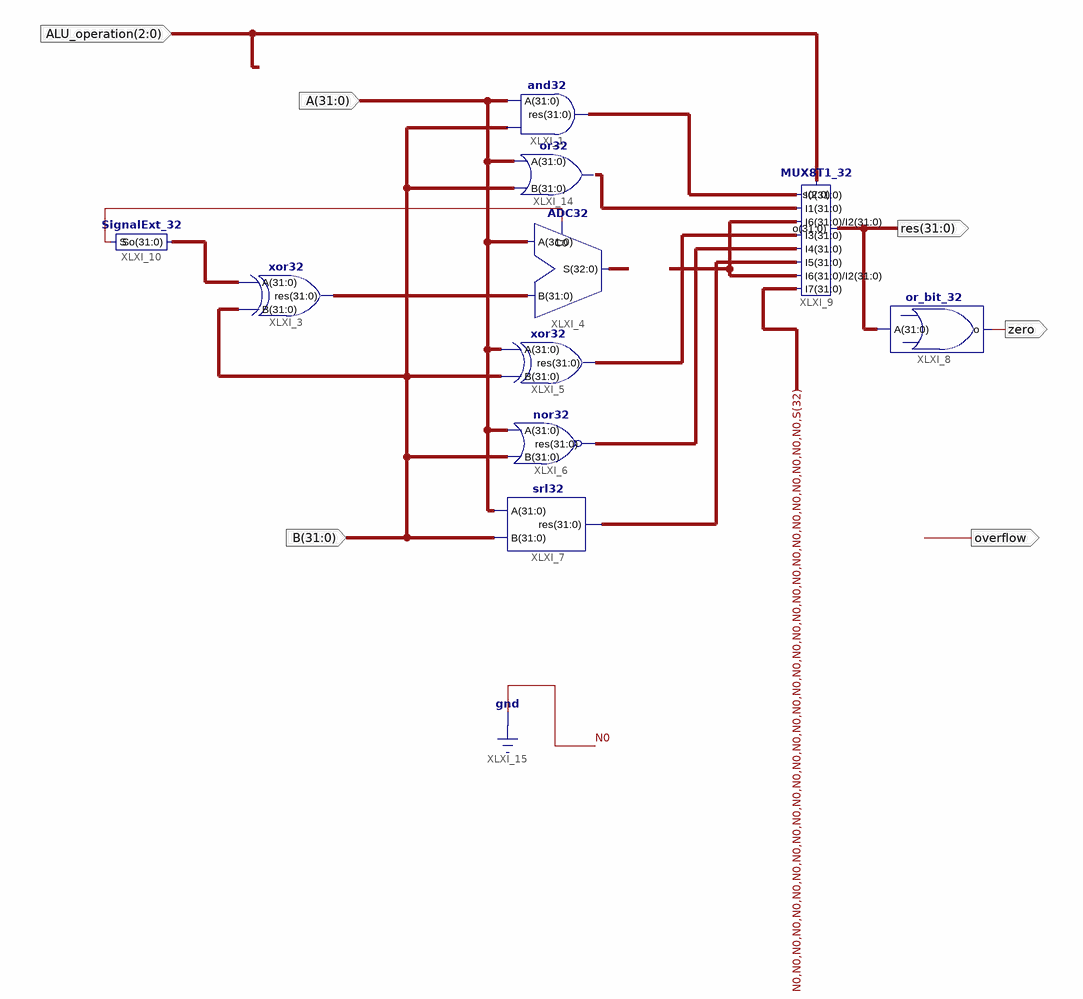
[diagram p0: schematic sheet 1]
// Xilinx ISE schematic ALU.sch (kintex7) as structural Verilog: 10 symbols, 6 ports
module ALU (
  input  [31:0] A,
  input  [31:0] B,
  input  [2:0] ALU_operation,
  output [31:0] res,
  output zero,
  output overflow
);

  wire [31:0] XLXN_14, XLXN_18, XLXN_19, XLXN_21, XLXN_50, XLXN_54, XLXN_58;
  wire [32:0] S;

  and32 XLXI_1 (.res(XLXN_14), .A(A), .B(B));
  xor32 XLXI_3 (.A(XLXN_50), .B(B), .res(XLXN_54));
  ADC32 XLXI_4 (.B(XLXN_54), .A(A), .C0(ALU_operation[2]), .S(S));
  xor32 XLXI_5 (.A(A), .B(B), .res(XLXN_18));
  nor32 XLXI_6 (.res(XLXN_19), .A(A), .B(B));
  srl32 XLXI_7 (.A(A), .B(B), .res(XLXN_21));
  or_bit_32 XLXI_8 (.o(zero), .A(res));
  MUX8T1_32 XLXI_9 (
    .s(ALU_operation), .I7({{31{1'b0}}, S[32]}), .I6(S[31:0]), .I5(XLXN_21), .I4(XLXN_19), .I3(XLXN_18),
    .I2(S[31:0]), .I1(XLXN_58), .I0(XLXN_14), .o(res));
  SignalExt_32 XLXI_10 (.So(XLXN_50), .S(ALU_operation[2]));
  or32 XLXI_14 (.res(XLXN_58), .A(A), .B(B));
endmodule
